# EAGLE design distribution (EAGLE 6.5.0)
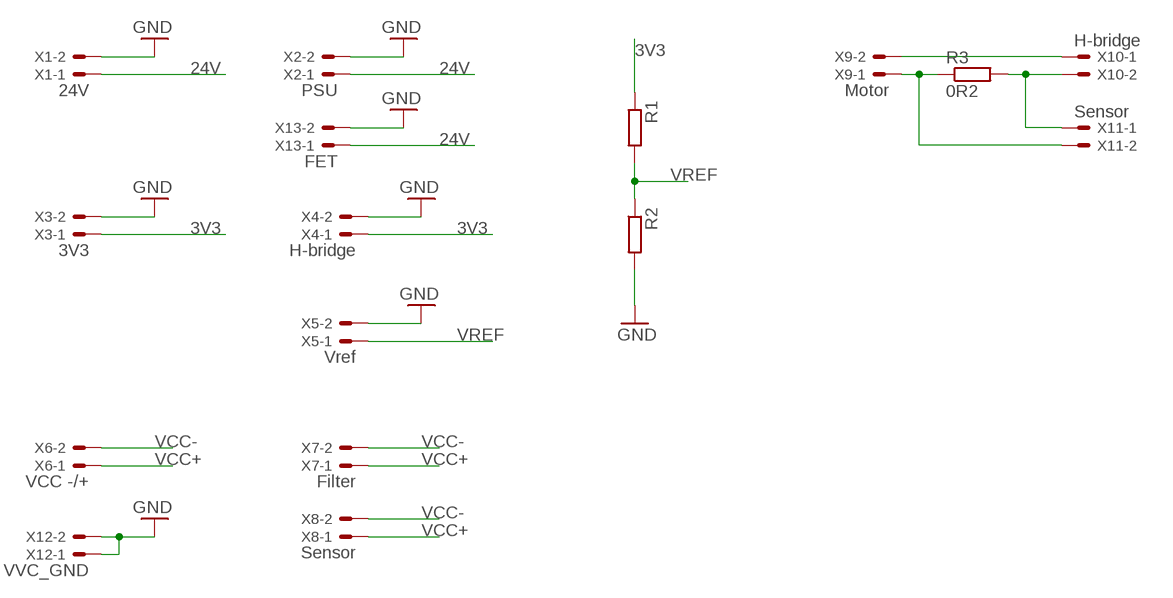
[diagram p0: schematic, sheet 1]

## Parts
R1  R-EU_0207/10  [0207/10]
R2  R-EU_0207/10  [0207/10]
R3  0R2  R-EU_0414/15  [0414/15]
X1  24V  22-23-2021  [22-23-2021]
X2  PSU  22-23-2021  [22-23-2021]
X3  3V3  22-23-2021  [22-23-2021]
X4  H-bridge  22-23-2021  [22-23-2021]
X5  Vref  22-23-2021  [22-23-2021]
X6  VCC -/+  22-23-2021  [22-23-2021]
X7  Filter  22-23-2021  [22-23-2021]
X8  Sensor  22-23-2021  [22-23-2021]
X9  Motor  22-23-2021  [22-23-2021]
X10  H-bridge  22-23-2021  [22-23-2021]
X11  Sensor  22-23-2021  [22-23-2021]
X12  VVC_GND  22-23-2021  [22-23-2021]
X13  FET  22-23-2021  [22-23-2021]

## Nets
3V3: R1.1 X3.1 X4.1
24V: X1.1 X2.1 X13.1
GND: R2.2 X1.2 X2.2 X3.2 X4.2 X5.2 X12.1 X12.2 X13.2
N$1: R3.1 X9.1 X11.2
N$2: R3.2 X10.2 X11.1
N$3: X9.2 X10.1
VCC+: X6.1 X7.1 X8.1
VCC-: X6.2 X7.2 X8.2
VREF: R1.2 R2.1 X5.1

## Library data of the parts
R1 R2 = resistor:R-EU_: RESISTOR, European symbol
R3 = rcl:R-EU_: RESISTOR, European symbol
X1-X13 = con-molex:22-23-2021: .100" (2.54mm) Center Header - 2 Pin; MF: MOLEX; MPN: 22-23-2021; OC_FARNELL: 1462926; OC_NEWARK: 25C3832

## Board
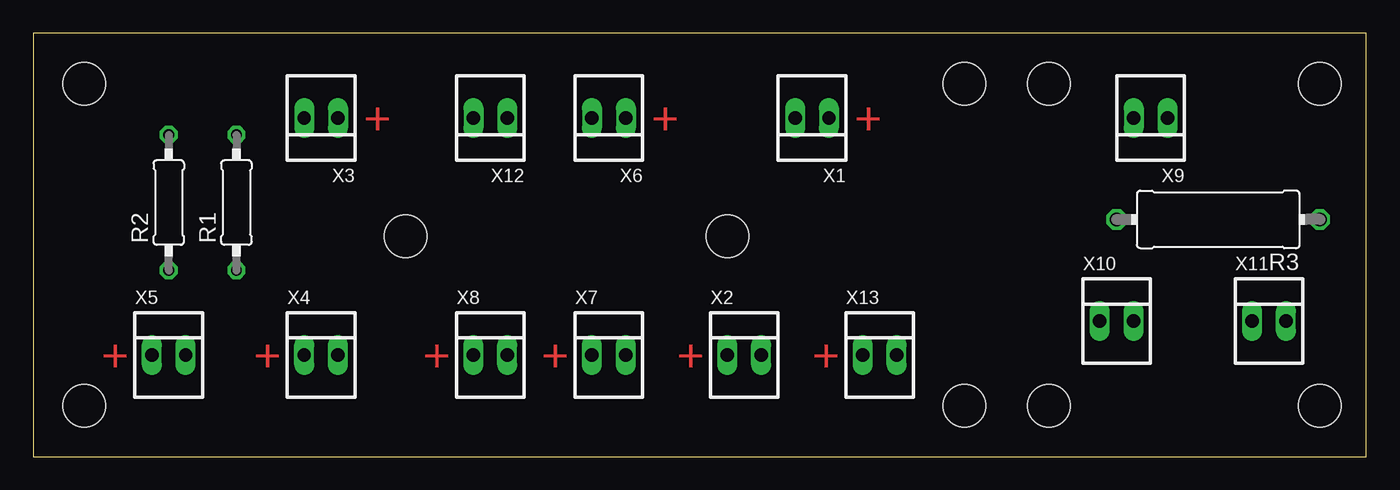
[diagram p1: board, top side]
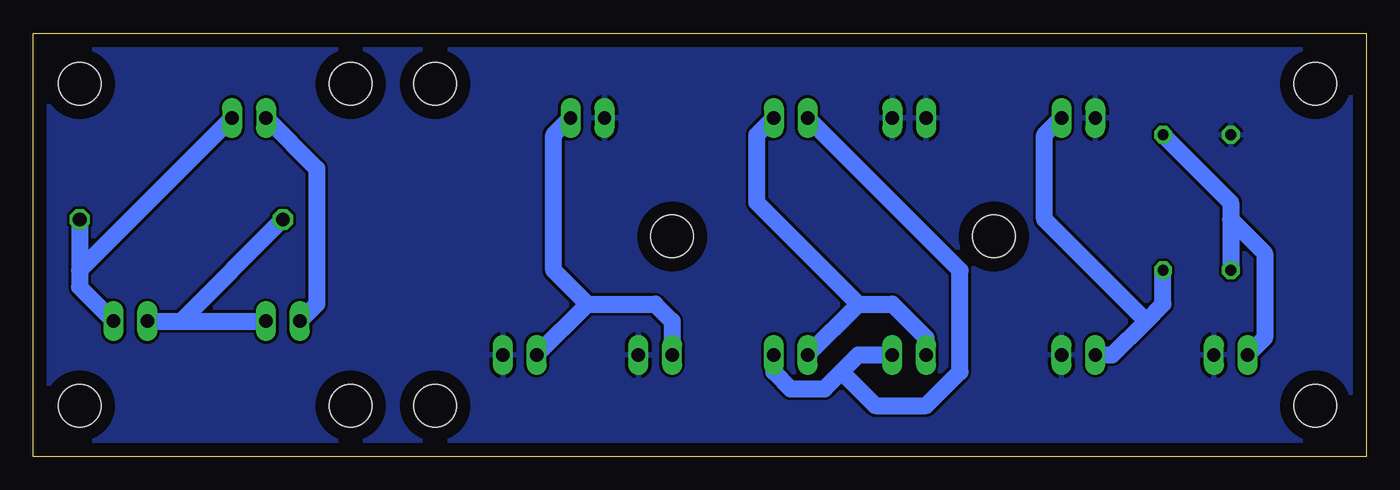
[diagram p2: board, bottom side, seen from below]

Size 100 x 31.74 mm. Coordinates in mm from the lower left corner, seen from the top.
Outline: 0,0 100,0 100,31.74 0,31.74 0,0
Copper layers (1*16): Top 0.035mm / dielectric 1.5mm / Bottom 0.035mm
Design rules "default *": minimum track width 50mil, minimum drill 24mil, track to track 8mil, track to pad 8mil, pad to pad 8mil, via to via 8mil, smd to smd 8mil, copper to edge 40mil, drill to drill 8mil, minimum pad ring 10mil, minimum via ring 8mil, stop-mask expansion 4mil, vias tented up to drill 0mil, thermal gap 10mil
Holes 3.2 mm at 3.81,27.94 3.81,3.81 69.85,3.81 69.85,27.94 76.2,27.94 96.52,27.94 76.2,3.81 96.52,3.81 27.94,16.51 52.07,16.51

### Footprints (pad centres in the part's own frame; a part is rotated, then mirrored left to right if it is on the bottom)
0207/10 = drill 0.813 octagon: 1 -5.08,0; 2 5.08,0
0414/15 = drill 1.016 octagon: 1 -7.62,0; 2 7.62,0
22-23-2021 = drill 1 long: 1 -1.27,0; 2 1.27,0

### Placement (x,y rotation side)
R1  15.24,19.05 90 top
R2  10.16,19.05 90 top
R3  88.9,17.78 180 top
X1  58.42,25.4 180 top
X2  53.34,7.62 0 top
X3  21.59,25.4 180 top
X4  21.59,7.62 0 top
X5  10.16,7.62 0 top
X6  43.18,25.4 180 top
X7  43.18,7.62 0 top
X8  34.29,7.62 0 top
X9  83.82,25.4 180 top
X10  81.28,10.16 0 top
X11  92.71,10.16 0 top
X12  34.29,25.4 180 top
X13  63.5,7.62 0 top

### Tracks (layer width: path | path; a pad name or v marks a point on that pad's centre or on a via)
3V3
  Bottom 1.27: R1.1 15.24,11.43 16.51,10.16 | 16.51,10.16 19.05,7.62 X4.1 | X3.1 24.13,24.13 24.13,17.78 16.51,10.16
24V
  Bottom 1.27: X2.1 52.07,10.16 53.34,11.43 58.42,11.43 | X13.1 58.42,11.43 | X1.1 60.96,24.13 60.96,13.97 58.42,11.43
GND
  pour Bottom: 0,31.75 100.33,31.75 100.33,0 0,0
N$1
  Bottom 1.27: X11.2 96.52,12.7 96.52,13.97 | R3.1 96.52,13.97 | 96.52,13.97 X9.1
N$2
  Bottom 1.27: X11.1 88.9,10.16 | 88.9,10.16 X10.2 | 88.9,10.16 R3.2
N$3
  Bottom 1.27: X10.1 78.74,11.43 78.74,21.59 X9.2
VCC+
  Bottom 1.27: X8.1 33.02,8.89 35.56,11.43 38.1,11.43 | X7.1 38.1,11.43 | X6.1 45.72,24.13 45.72,19.05 38.1,11.43
VCC-
  Bottom 1.27: X8.2 38.1,7.62 39.37,6.35 | 39.37,6.35 40.64,5.08 43.18,5.08 44.45,6.35 X7.2 | X6.2 30.48,13.97 30.48,6.35 33.02,3.81 36.83,3.81 39.37,6.35
VREF
  Bottom 1.27: 10.16,17.78 10.16,19.05 R1.2 | 10.16,17.78 R2.1 | X5.1 7.62,8.89 7.62,15.24 10.16,17.78

### Text on the board
Top: + | + | + | + | + | + | + | + | +